# Altium schematic sheet TSE_power_control_board_main.SchDoc
size 420 x 297 mm; SheetNumber: 1; SheetTotal: 2
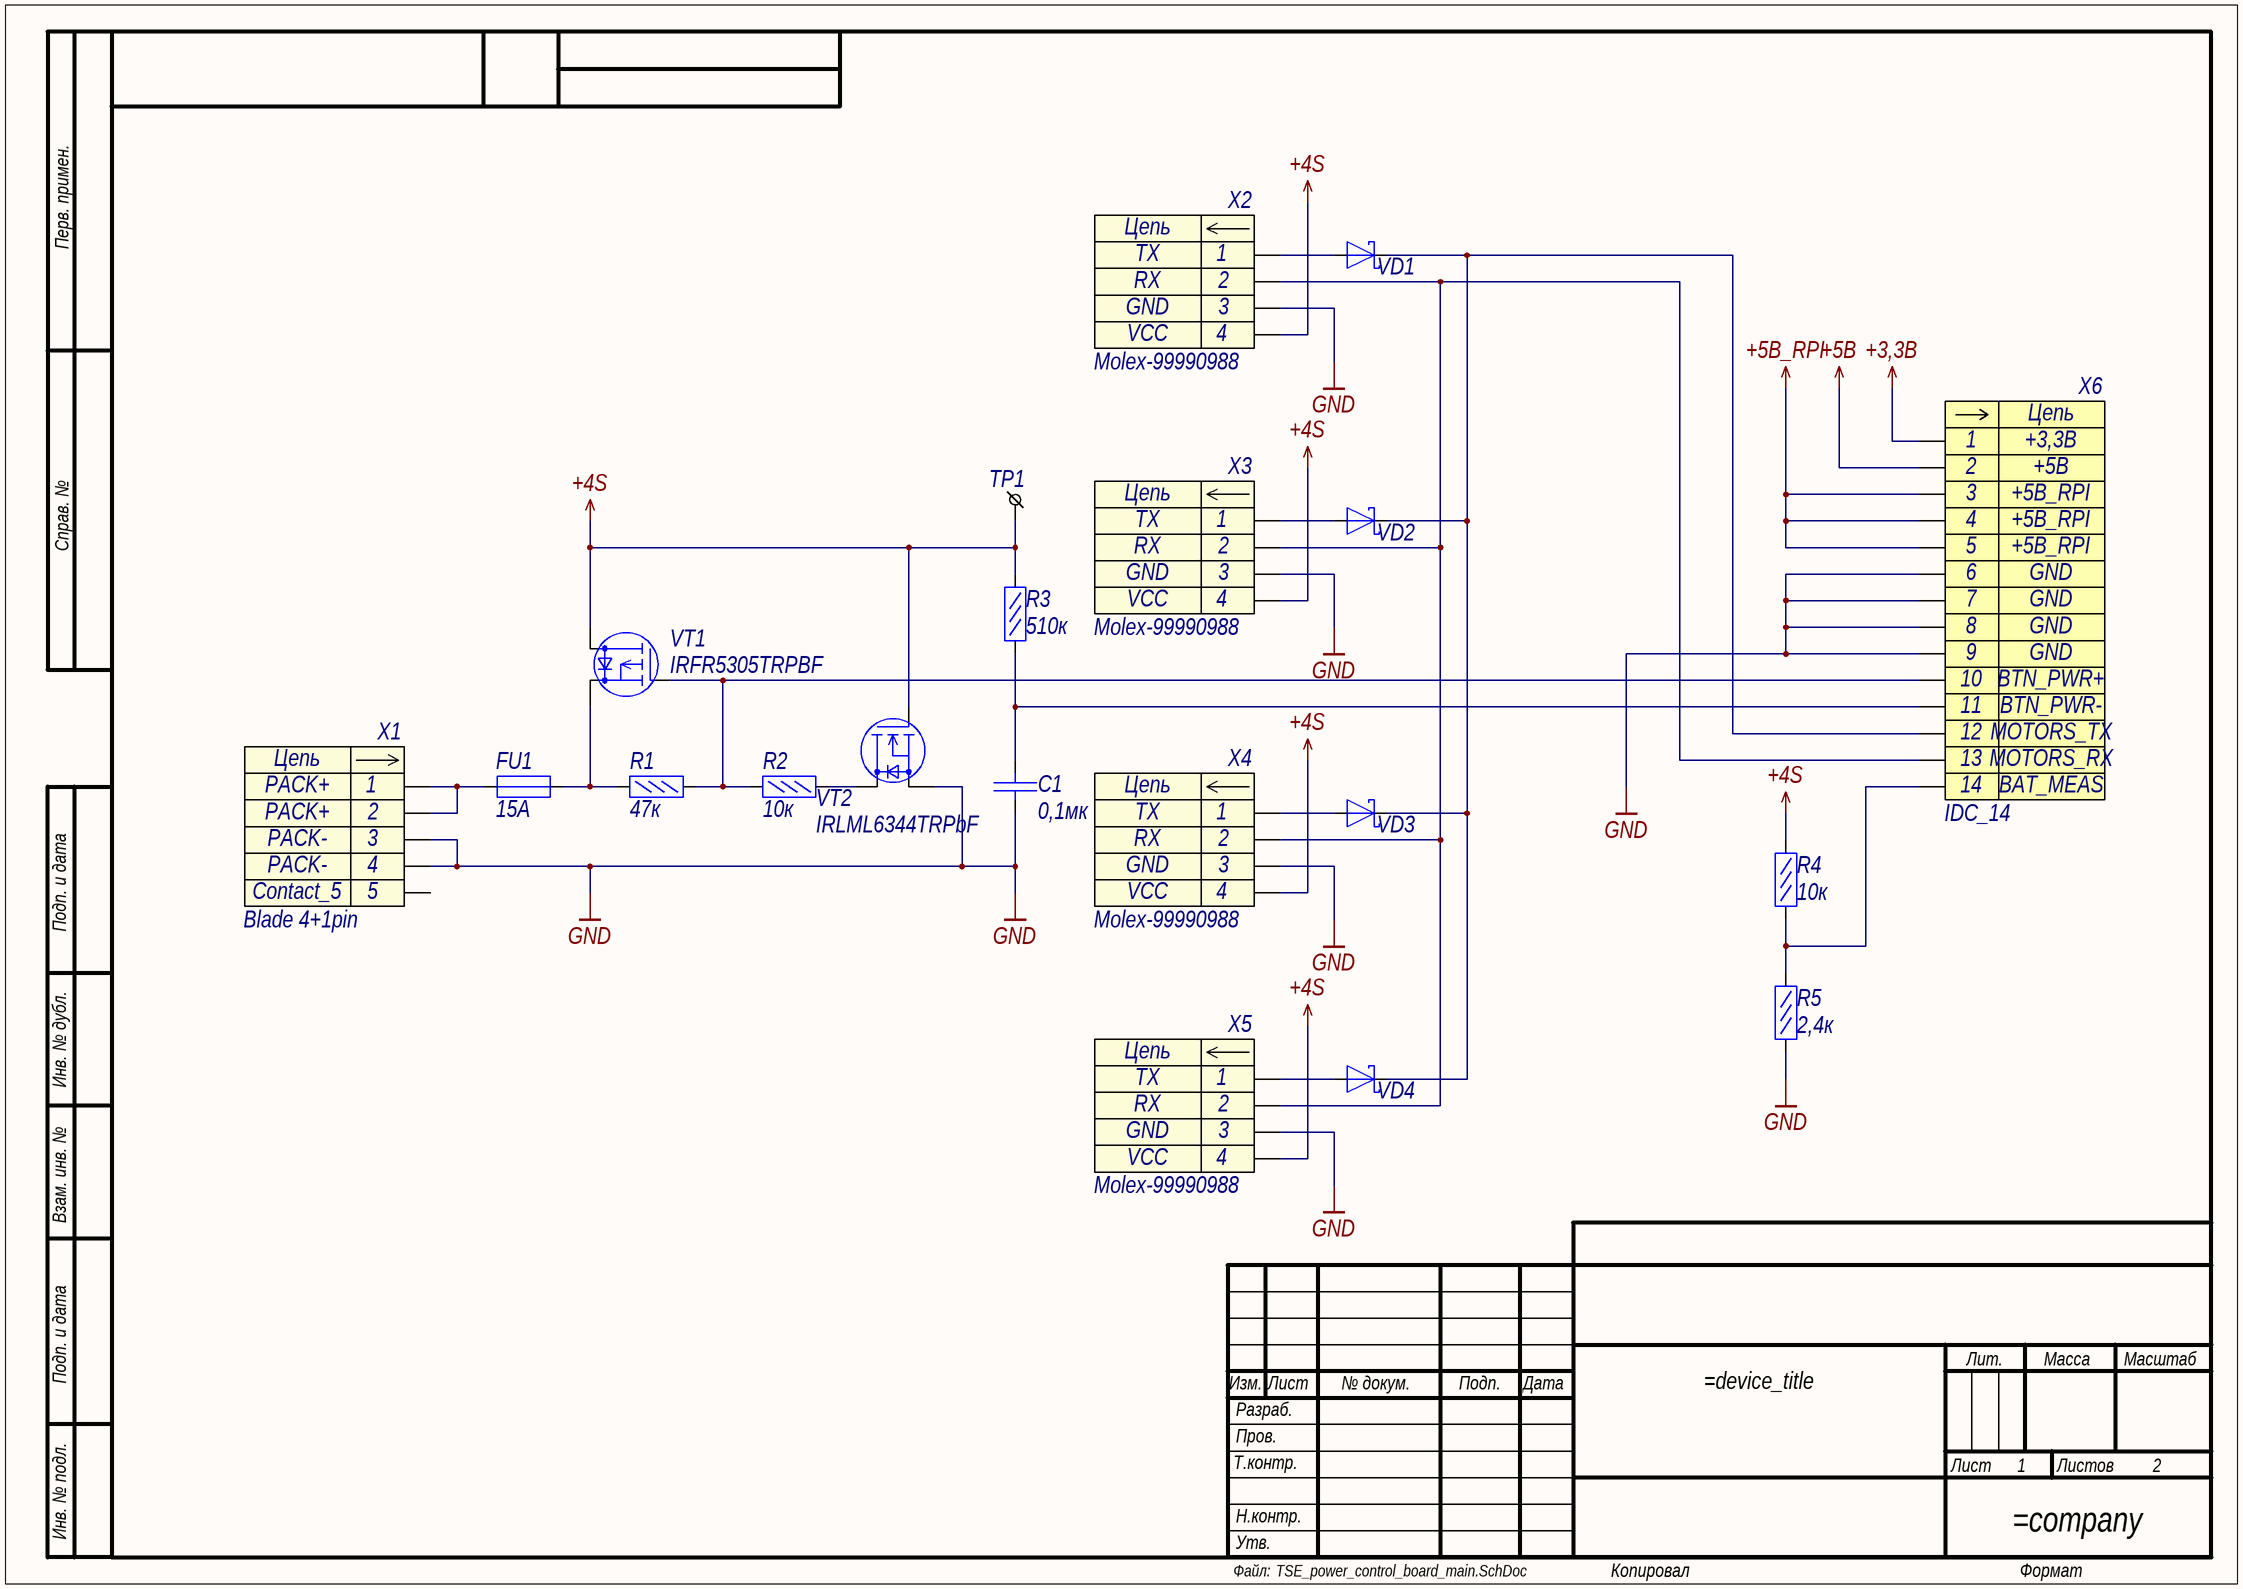
[diagram p0: TSE_power_control_board_main.SchDoc]

## Parts
C1  0,1мк  [C0603]
FU1  15А  [FU2410]
R1  47к  [R0603]
R2  10к  [R0603]
R3  510к  [R0603]
R4  10к  [R0603]
R5  2,4к  [R0603]
TP1  +4S  [TP_0,6X1]  (value not drawn)  (no BOM)
VD1  1N5817WS  [SOD323]  (value not drawn)
VD2  1N5817WS  [SOD323]  (value not drawn)
VD3  1N5817WS  [SOD323]  (value not drawn)
VD4  1N5817WS  [SOD323]  (value not drawn)
VT1  IRFR5305TRPBF  [D-PAK]
VT2  IRLML6344TRPbF  [SOT23-3]
X1  Blade 4+1pin  [Blade 4+1P M]
X2  Molex-99990988  [Molex-99990988]
X3  Molex-99990988  [Molex-99990988]
X4  Molex-99990988  [Molex-99990988]
X5  Molex-99990988  [Molex-99990988]
X6  IDC_14  [IDC1.27_14]

## Nets
+3,3В: X6.1
+4S: R3.2 R4.2 TP1.1 VT1.2(D) VT2.1(G) X2.4 X3.4 X4.4 X5.4
+5В: X6.2
+5В_RPI: X6.3 X6.4 X6.5
GND: C1.1 R5.1 VT2.2(S) X1.3 X1.4 X2.3 X3.3 X4.3 X5.3 X6.6 X6.7 X6.8 X6.9
NetC1_2: C1.2 R3.1 X6.11
NetFU1_1: FU1.1 X1.1 X1.2
NetFU1_2: FU1.2 R1.1 VT1.3(S)
NetR1_2: R1.2 R2.2 VT1.1(G) X6.10
NetR2_1: R2.1 VT2.3(D)
NetR4_1: R4.1 R5.2 X6.14
NetVD1_1: VD1.1(K) VD2.1(K) VD3.1(K) VD4.1(K) X6.12
NetVD1_2: VD1.2(A) X2.1
NetVD2_2: VD2.2(A) X3.1
NetVD3_2: VD3.2(A) X4.1
NetVD4_2: VD4.2(A) X5.1
NetX2_2: X2.2 X3.2 X4.2 X5.2 X6.13

## Notes on the sheet
- Перв. примен.
- Справ. №
- Подп. и дата
- Инв. № дубл.
- Взам. инв. №
- Изм.
- Лист
- № докум.
- Подп.
- Дата
- Лит.
- Масса
- Масштаб
- Т.контр.
- Пров.
- Разраб.
- Листов
- Инв. № подл.
- Н.контр.
- Файл:
- Утв.
- Копировал
- Формат
- (in symbol Blade 4+1P M) Цепь; 5
- (in symbol IDC_14) Цепь
- (in symbol Molex-99990988) Цепь

## Library data of the parts
C1 = CC0603JPX7R9BB104: Конденсатор кер. 0,1мкФ 50В; Manufacturer: Yageo; TKE: X7R; Name: CC0603JPX7R9BB104; Value: 0,1мк
FU1 = fuse: Предохранитель SMD; Value: 15А
R1 = RC0603FR-0747KL: Резистор 47кОм 0,063Вт 1%; Manufacturer: YAGEO; Name: RC0603FR-0747KL; Tolerance: 1%; Value: 47к
R2 R4 = RC0603FR-0710KL: Резистор 10кОм 0,063Вт 1%; Manufacturer: YAGEO; Name: RC0603FR-0710KL; Tolerance: 1%; Value: 10к
R3 = RC0603FR-07510KL: Резистор 510кОм 0,1Вт 1%; Manufacturer: YAGEO; Name: RC0603FR-07510KL; Tolerance: 1%; Value: 510к
R5 = RC0603FR-072K4L: Резистор 2,4 кОм 0,1Вт 1%; Value: 2,4к
TP1 = TESTPOINT_HOLE: Name: +4S
VD1-VD4 = 1N5817WS: Диод Шоттки 1N5817WS 20V 1А 0.45V; Производитель: Hottech Co. Ltd; current: 1A; voltage: 20В; drop voltage: 0,45В; Name: 1N5817WS
VT1 = IRFR5305TRPBF: Транзистор полевой P-канальный -55В -31А 110Вт 0,065Ом; Name: IRFR5305TRPBF
VT2 = IRLML6344TRPbF: N-MOSFET 30В 5А; Наименование: IRLML6344TRPbF
X1 = Blade 4+1P M: Ножевой разъём - 4 конт. прямая вилка на плату с шагом 2.54мм; Contact_1: PACK+; Contact_3: PACK-; Contact_2: PACK+; Contact_4: PACK-; Наименование: Blade 4+1pin; Contact_5: Contact_5
X2-X5 = Molex-99990988: Разъем - 4 конт. прямая вилка на плату, шаг 2,50 мм; Contact_1: TX; Contact_2: RX; Contact_3: GND; Contact_4: VCC; Наименование: Molex-99990988
X6 = IDC_14: Разъем - 14 конт. прямая вилка на плату; Contact_1: +3,3В; Contact_2: +5В; Contact_3: +5В_RPI; Contact_6: GND; Contact_10: BTN_PWR+; Contact_11: BTN_PWR-; Contact_12: MOTORS_TX; Contact_13: MOTORS_RX; Contact_14: BAT_MEAS; Наименование: IDC_14; Contact_4: +5В_RPI; Contact_5: +5В_RPI; Contact_7: GND; Contact_8: GND; Contact_9: GND